# Altium schematic sheet FPGA_10_100 Ethernet PHY.SchDoc
size A4
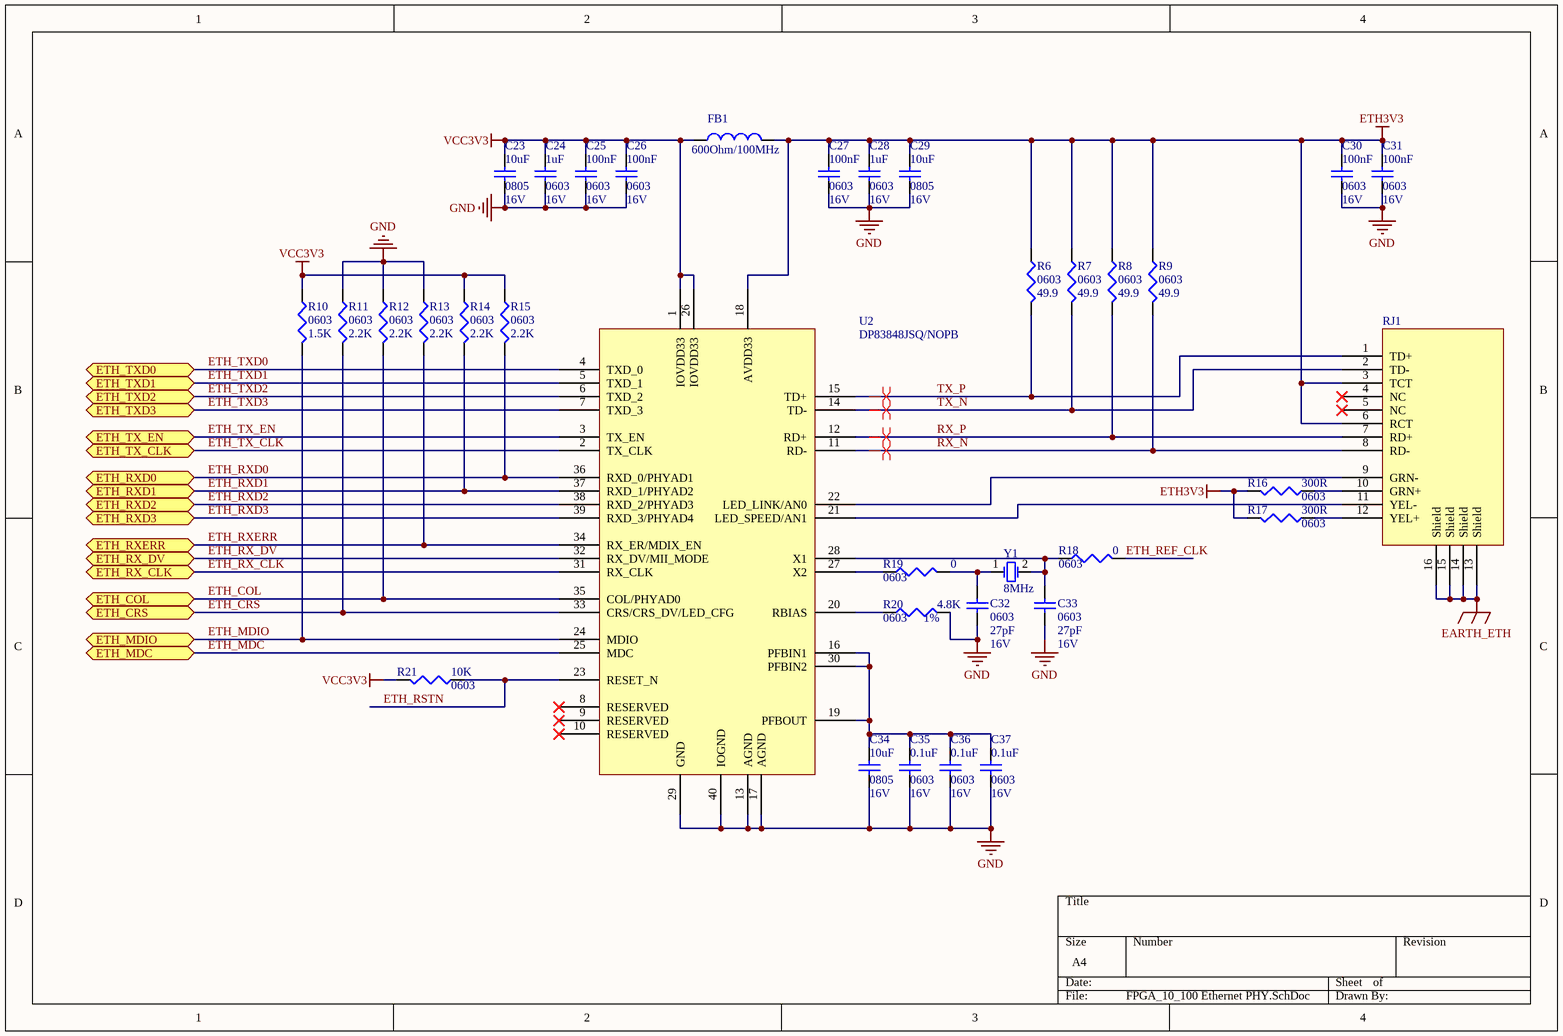
[diagram p0: FPGA_10_100 Ethernet PHY.SchDoc]

## Parts
C23  PackageReference: 0805  V: 16V  [2012[0805]]  (hidden comment: 10uF)
C24  PackageReference: 0603  V: 16V  [1608[0603]]  (hidden comment: 1uF)
C25  PackageReference: 0603  V: 16V  [1608[0603]]  (hidden comment: 100nF)
C26  PackageReference: 0603  V: 16V  [1608[0603]]  (hidden comment: 100nF)
C27  PackageReference: 0603  V: 16V  [1608[0603]]  (hidden comment: 100nF)
C28  PackageReference: 0603  V: 16V  [1608[0603]]  (hidden comment: 1uF)
C29  PackageReference: 0805  V: 16V  [2012[0805]]  (hidden comment: 10uF)
C30  PackageReference: 0603  V: 16V  [1608[0603]]  (hidden comment: 100nF)
C31  PackageReference: 0603  V: 16V  [1608[0603]]  (hidden comment: 100nF)
C32  PackageReference: 0603  V: 16V  [1608[0603]]  (hidden comment: 27pF)
C33  PackageReference: 0603  V: 16V  [1608[0603]]  (hidden comment: 27pF)
C34  PackageReference: 0805  V: 16V  [2012[0805]]  (hidden comment: 10uF)
C35  PackageReference: 0603  V: 16V  [1608[0603]]  (hidden comment: 0.1uF)
C36  PackageReference: 0603  V: 16V  [1608[0603]]  (hidden comment: 0.1uF)
C37  PackageReference: 0603  V: 16V  [1608[0603]]  (hidden comment: 0.1uF)
FB1  600Ohm/100MHz  [2012[0805]]
R6  value 49.9  PackageReference: 0603  [1608[0603]]  (hidden comment: Res3)
R7  value 49.9  PackageReference: 0603  [1608[0603]]  (hidden comment: Res3)
R8  value 49.9  PackageReference: 0603  [1608[0603]]  (hidden comment: Res3)
R9  value 49.9  PackageReference: 0603  [1608[0603]]  (hidden comment: Res3)
R10  value 1.5K  PackageReference: 0603  [1608[0603]]  (hidden comment: Res3)
R11  value 2.2K  PackageReference: 0603  [1608[0603]]  (hidden comment: Res3)
R12  value 2.2K  PackageReference: 0603  [1608[0603]]  (hidden comment: Res3)
R13  value 2.2K  PackageReference: 0603  [1608[0603]]  (hidden comment: Res3)
R14  value 2.2K  PackageReference: 0603  [1608[0603]]  (hidden comment: Res3)
R15  value 2.2K  PackageReference: 0603  [1608[0603]]  (hidden comment: Res3)
R16  value 300R  PackageReference: 0603  [1608[0603]]  (hidden comment: Res3)
R17  value 300R  PackageReference: 0603  [1608[0603]]  (hidden comment: Res3)
R18  value 0  PackageReference: 0603  [1608[0603]]  (hidden comment: Res3)
R19  value 0  PackageReference: 0603  [1608[0603]]  (hidden comment: Res3)
R20  value 4.8K  PackageReference: 0603  AC: 1%  [1608[0603]]  (hidden comment: Res3)
R21  value 10K  PackageReference: 0603  [1608[0603]]  (hidden comment: Res3)
RJ1  RJ45  [RJ45-1]  (value not drawn)
U2  DP83848JSQ/NOPB  [DP83848J]
Y1  8MHz  [XTAL_A]

## Ports
ETH_COL, ETH_CRS, ETH_MDC, ETH_MDIO, ETH_RX_CLK, ETH_RX_DV, ETH_RXD0, ETH_RXD1, ETH_RXD2, ETH_RXD3, ETH_RXERR, ETH_TX_CLK, ETH_TX_EN, ETH_TXD0, ETH_TXD1, ETH_TXD2, ETH_TXD3

## Nets
EARTH_ETH: RJ1.13(Shield) RJ1.14(Shield) RJ1.15(Shield) RJ1.16(Shield)
ETH3V3: C27.1 C28.1 C29.1 C30.1 C31.1 FB1.2 R6.1 R7.1 R8.1 R9.1 R16.2 R17.2 RJ1.3(TCT) RJ1.6(RCT) U2.18(AVDD33)
GND: C23.2 C24.2 C25.2 C26.2 C27.2 C28.2 C29.2 C30.2 C31.2 C32.2 C33.2 C34.2 C35.2 C36.2 C37.2 R11.1 R12.1 R13.1 R20.2 U2.13(AGND) U2.17(AGND) U2.29(GND) U2.40(IOGND)
VCC3V3: C23.1 C24.1 C25.1 C26.1 FB1.1 R10.1 R14.1 R15.1 R21.2 U2.1(IOVDD33) U2.26(IOVDD33)
ETH_COL: R12.2 U2.35(COL/PHYAD0) ; port ETH_COL
ETH_CRS: R11.2 U2.33(CRS/CRS_DV/LED_CFG) ; port ETH_CRS
ETH_MDC: U2.25(MDC) ; port ETH_MDC
ETH_MDIO: R10.2 U2.24(MDIO) ; port ETH_MDIO
ETH_REF_CLK: R18.2
ETH_RSTN: R21.1 U2.23(RESET_N)
ETH_RX_CLK: U2.31(RX_CLK) ; port ETH_RX_CLK
ETH_RX_DV: U2.32(RX_DV/MII_MODE) ; port ETH_RX_DV
ETH_RXD0: R15.2 U2.36(RXD_0/PHYAD1) ; port ETH_RXD0
ETH_RXD1: R14.2 U2.37(RXD_1/PHYAD2) ; port ETH_RXD1
ETH_RXD2: U2.38(RXD_2/PHYAD3) ; port ETH_RXD2
ETH_RXD3: U2.39(RXD_3/PHYAD4) ; port ETH_RXD3
ETH_RXERR: R13.2 U2.34(RX_ER/MDIX_EN) ; port ETH_RXERR
ETH_TX_CLK: U2.2(TX_CLK) ; port ETH_TX_CLK
ETH_TX_EN: U2.3(TX_EN) ; port ETH_TX_EN
ETH_TXD0: U2.4(TXD_0) ; port ETH_TXD0
ETH_TXD1: U2.5(TXD_1) ; port ETH_TXD1
ETH_TXD2: U2.6(TXD_2) ; port ETH_TXD2
ETH_TXD3: U2.7(TXD_3) ; port ETH_TXD3
RX_N: R9.2 RJ1.8(RD-) U2.11(RD-)
RX_P: R8.2 RJ1.7(RD+) U2.12(RD+)
TX_N: R7.2 RJ1.2(TD-) U2.14(TD-)
TX_P: R6.2 RJ1.1(TD+) U2.15(TD+)
NetC32_1: C32.1 R19.2 Y1.1(OSC1)
NetC33_1: C33.1 R18.1 U2.28(X1) Y1.2(OSC2)
NetC34_1: C34.1 C35.1 C36.1 C37.1 U2.16(PFBIN1) U2.19(PFBOUT) U2.30(PFBIN2)
NetR16_1: R16.1 RJ1.10(GRN+)
NetR17_1: R17.1 RJ1.12(YEL+)
NetR19_1: R19.1 U2.27(X2)
NetR20_1: R20.1 U2.20(RBIAS)
NetRJ1_9: RJ1.9(GRN-) U2.22(LED_LINK/AN0)
NetRJ1_11: RJ1.11(YEL-) U2.21(LED_SPEED/AN1)

Not connected (* = marked no-connect by the designer): RJ1 4(NC)* 5(NC)*; U2 8(RESERVED)* 9(RESERVED)* 10(RESERVED)*

## Layout directives
differential pair: RX_N, RX_P, TX_N, TX_P

## Library data of the parts
C23-C37 = Cap Semi: Capacitor (Semiconductor SIM Model); LatestRevisionDate: 17-Jul-2002; LatestRevisionNote: Re-released for DXP Platform.; Publisher: Altium Limited
  C23 C29 C34: Value: 10uF
  C24 C28: Value: 1uF
  C25-C27 C30 C31: Value: 100nF
  C32 C33: Value: 27pF
  C35-C37: Value: 0.1uF
FB1 = Inductor: Value: 600Ohm/100MHz
R6-R21 = Res3: Resistor; Published: 8-Jun-2000; LatestRevisionDate: 29-May-2009; LatestRevisionNote: IPC-7351 Footprint Added.; Publisher: Altium Limited; PackageDescription: Chip Resistor
RJ1 = RJ45: 网口座
Y1 = XTAL: Crystal Oscillator; Published: 8-Jun-2000; LatestRevisionDate: 17-Jul-2002; LatestRevisionNote: Re-released for DXP Platform.; PackageReference: R38; Publisher: Altium Limited; Value: 8MHz